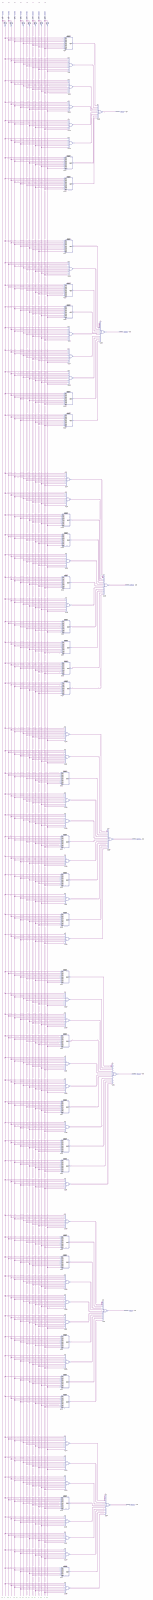
[diagram p0: schematic sheet, whole]
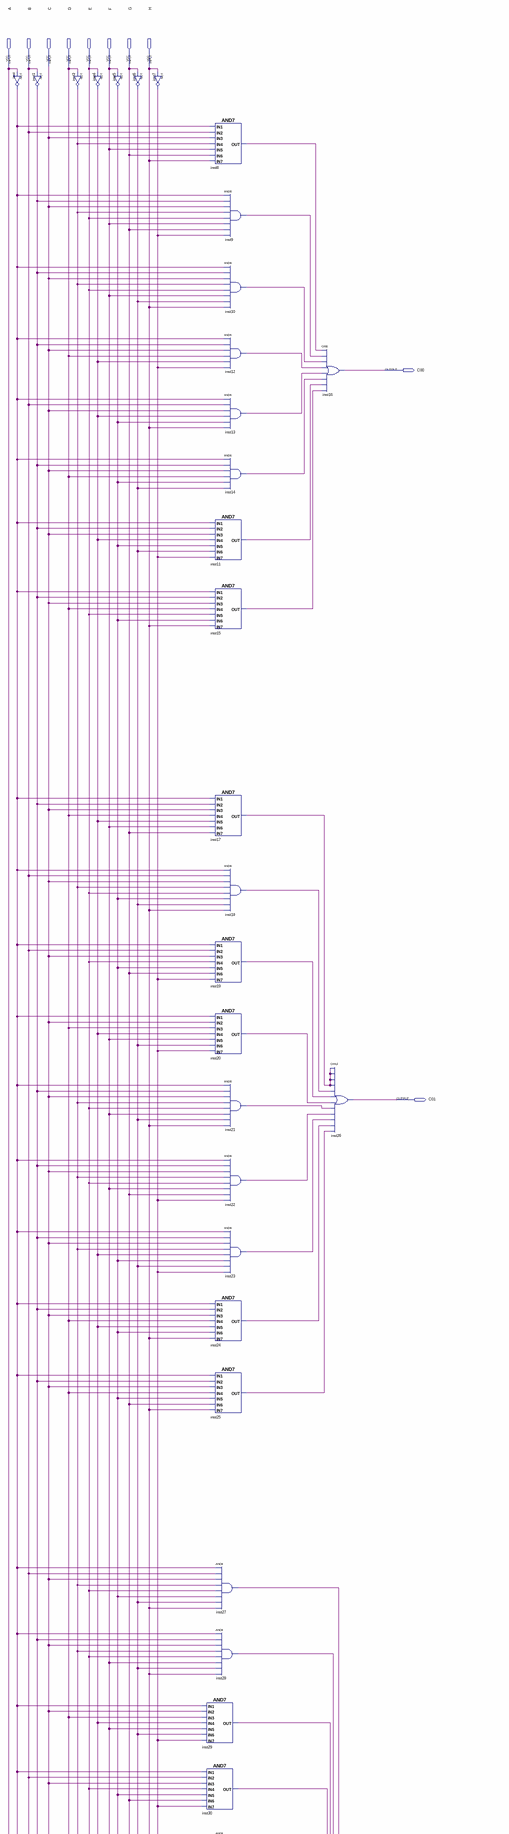
[diagram p1: schematic sheet, upper part]
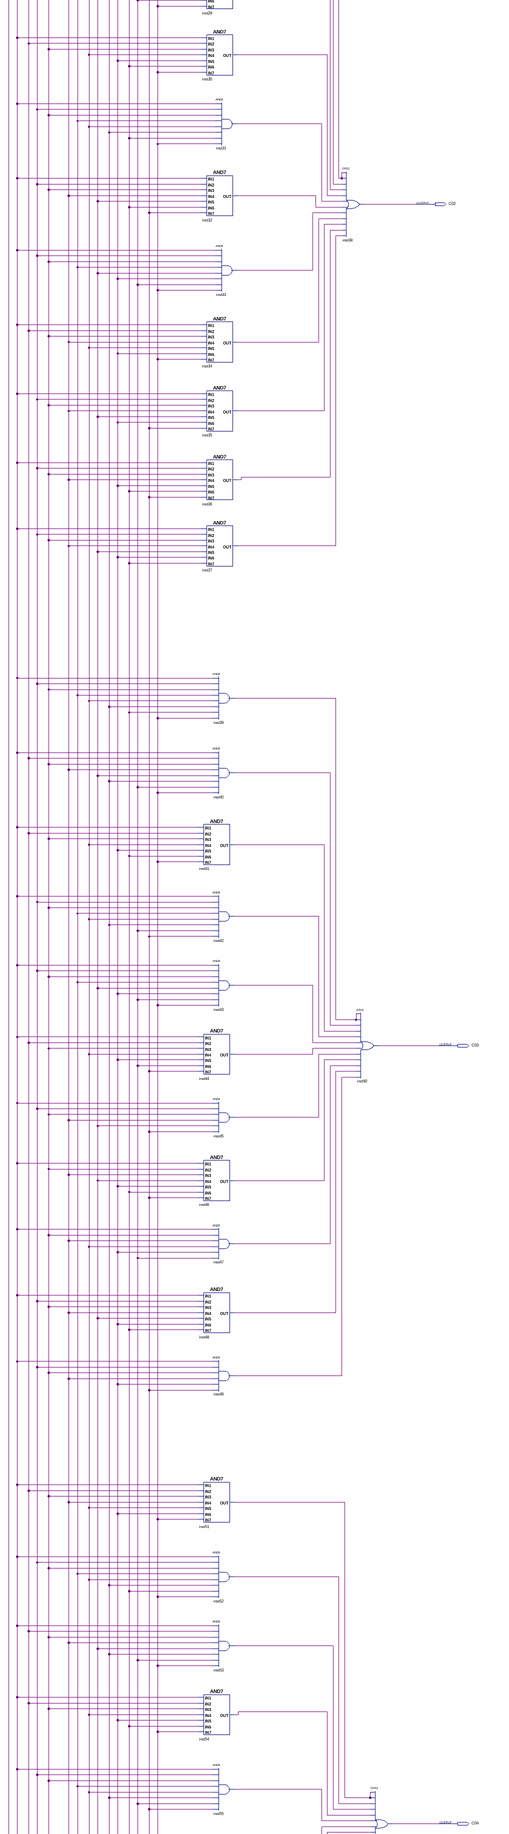
[diagram p2: schematic sheet, middle part]
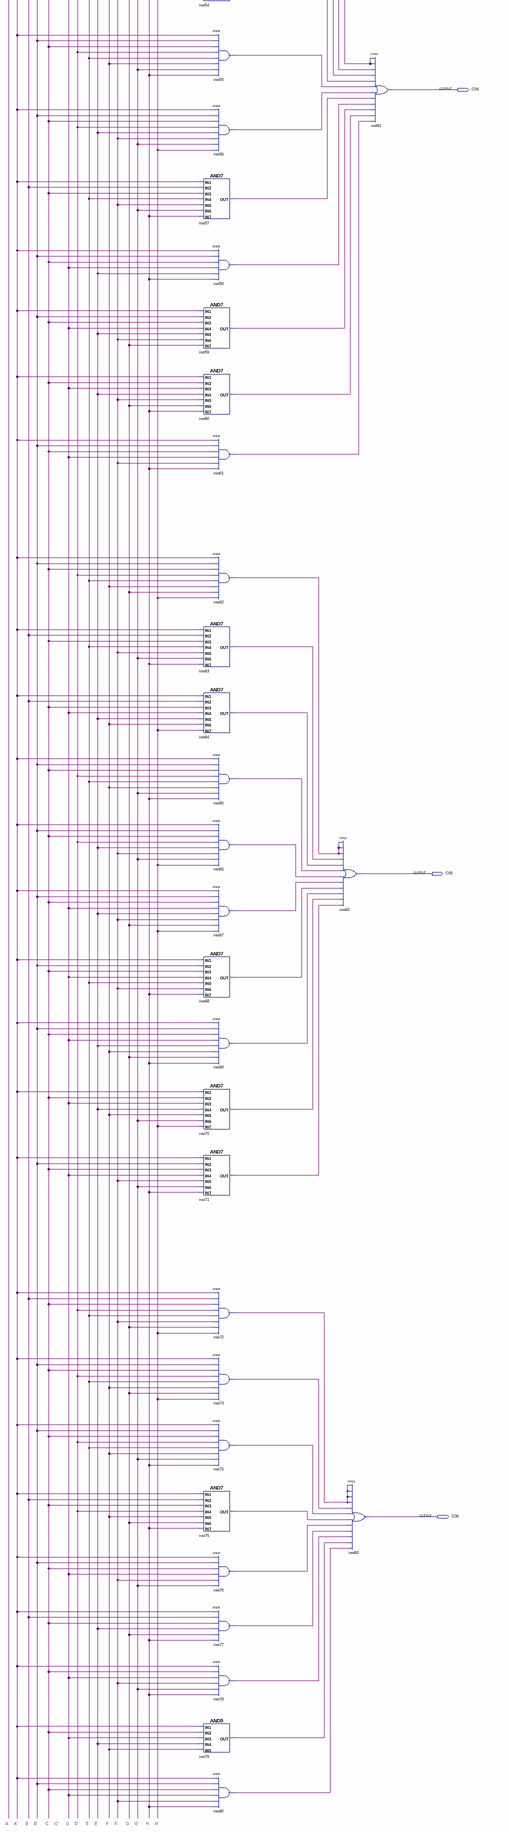
[diagram p3: schematic sheet, lower part]
// Quartus schematic matriz_coluna0.bdf as structural Verilog: 83 symbols, 15 pins
module matriz_coluna0 (
  input  A,
  input  B,
  input  C,
  input  D,
  input  E,
  input  F,
  input  G,
  input  H,
  output C00,
  output C01,
  output C02,
  output C03,
  output C04,
  output C05,
  output C06
);

  wire inst1_out, inst3_out, inst4_out, inst5_out, inst6_out, inst7_out, inst8_out, inst9_out, inst10_out,
       inst11_out, inst12_out, inst13_out, inst14_out, inst15_out, inst17_out, inst18_out, inst19_out,
       inst20_out, inst21_out, inst22_out, inst23_out, inst24_out, inst25_out, inst27_out, inst28_out,
       inst29_out, inst30_out, inst31_out, inst32_out, inst33_out, inst34_out, inst35_out, inst36_out,
       inst37_out, inst39_out, inst40_out, inst41_out, inst42_out, inst43_out, inst44_out, inst45_out,
       inst46_out, inst47_out, inst48_out, inst49_out, inst51_out, inst52_out, inst53_out, inst54_out,
       inst55_out, inst56_out, inst57_out, inst58_out, inst59_out, inst60_out, inst61_out, inst62_out,
       inst63_out, inst64_out, inst65_out, inst66_out, inst67_out, inst68_out, inst69_out, inst70_out,
       inst71_out, inst72_out, inst73_out, inst74_out, inst75_out, inst76_out, inst77_out, inst78_out,
       inst79_out, inst80_out, inst_out;

  not inst (inst_out, A);
  not inst1 (inst1_out, B);
  not inst3 (inst3_out, D);
  not inst4 (inst4_out, E);
  not inst5 (inst5_out, F);
  not inst6 (inst6_out, G);
  not inst7 (inst7_out, H);
  and inst8 (inst8_out, inst_out, B, C, inst3_out, F, G, H);
  and inst11 (inst11_out, inst_out, inst1_out, C, inst4_out, inst5_out, inst6_out, inst7_out);
  and inst15 (inst15_out, inst_out, inst1_out, C, D, E, inst5_out, H);
  and inst17 (inst17_out, inst_out, inst1_out, C, D, inst4_out, F, G);
  and inst19 (inst19_out, inst_out, B, C, E, inst5_out, G, inst7_out);
  and inst20 (inst20_out, inst_out, C, D, inst4_out, F, inst6_out, inst7_out);
  and inst24 (inst24_out, inst_out, inst1_out, C, D, inst4_out, inst5_out, H);
  and inst25 (inst25_out, inst_out, inst1_out, C, D, inst5_out, G, H);
  and inst27 (inst27_out, inst_out, B, C, inst3_out, E, inst5_out, inst6_out, H);
  and inst28 (inst28_out, inst_out, inst1_out, C, inst3_out, E, F, inst6_out, H);
  and inst29 (inst29_out, inst_out, C, D, inst4_out, F, inst6_out, inst7_out);
  and inst30 (inst30_out, inst_out, B, C, E, inst5_out, G, inst7_out);
  and inst31 (inst31_out, inst_out, inst1_out, C, inst3_out, E, F, G, inst7_out);
  and inst32 (inst32_out, inst_out, inst1_out, C, D, inst4_out, G, H);
  and inst33 (inst33_out, inst_out, inst1_out, C, inst3_out, inst4_out, inst5_out, inst6_out, inst7_out);
  and inst34 (inst34_out, inst_out, B, C, D, E, inst5_out, inst7_out);
  and inst35 (inst35_out, inst_out, inst1_out, C, D, inst4_out, inst5_out, H);
  and inst36 (inst36_out, inst_out, inst1_out, C, D, inst5_out, G, H);
  and inst37 (inst37_out, inst_out, inst1_out, C, D, inst4_out, inst5_out, G);
  and inst39 (inst39_out, inst_out, inst1_out, C, inst3_out, E, F, G, inst7_out);
  and inst40 (inst40_out, inst_out, B, C, D, inst4_out, F, inst6_out, inst7_out);
  and inst41 (inst41_out, inst_out, B, C, E, inst5_out, G, inst7_out);
  and inst42 (inst42_out, inst_out, inst1_out, C, inst3_out, E, F, inst6_out, H);
  and inst43 (inst43_out, inst_out, inst1_out, C, inst3_out, inst4_out, inst5_out, inst6_out, inst7_out);
  and inst44 (inst44_out, inst_out, B, C, E, inst5_out, inst6_out, H);
  and inst45 (inst45_out, inst_out, inst1_out, C, D, inst4_out, H);
  and inst46 (inst46_out, inst_out, C, D, inst4_out, inst5_out, G, H);
  and inst47 (inst47_out, inst_out, C, D, E, inst5_out, inst6_out);
  and inst48 (inst48_out, inst_out, inst1_out, C, D, inst4_out, inst5_out, G);
  and inst49 (inst49_out, inst_out, inst1_out, C, D, inst5_out, H);
  and inst51 (inst51_out, inst_out, B, C, D, E, inst5_out, inst7_out);
  and inst52 (inst52_out, inst_out, inst1_out, C, inst3_out, E, F, G, inst7_out);
  and inst53 (inst53_out, inst_out, B, C, D, inst4_out, F, inst6_out, inst7_out);
  and inst54 (inst54_out, inst_out, B, C, E, inst5_out, G, inst7_out);
  and inst55 (inst55_out, inst_out, inst1_out, C, inst3_out, E, F, inst6_out, H);
  and inst56 (inst56_out, inst_out, inst1_out, C, inst3_out, inst4_out, inst5_out, inst6_out, inst7_out);
  and inst57 (inst57_out, inst_out, B, C, E, inst5_out, inst6_out, H);
  and inst58 (inst58_out, inst_out, inst1_out, C, D, inst4_out, H);
  and inst59 (inst59_out, inst_out, inst1_out, C, D, inst4_out, inst5_out, G);
  and inst60 (inst60_out, inst_out, C, D, inst4_out, inst5_out, G, H);
  and inst61 (inst61_out, inst_out, inst1_out, C, D, inst5_out, H);
  and inst62 (inst62_out, inst_out, inst1_out, C, inst3_out, E, F, G, inst7_out);
  and inst63 (inst63_out, inst_out, B, C, E, inst5_out, inst6_out, H);
  and inst64 (inst64_out, inst_out, B, C, D, inst4_out, F, inst7_out);
  and inst65 (inst65_out, inst_out, inst1_out, C, inst3_out, E, F, inst6_out, H);
  and inst66 (inst66_out, inst_out, inst1_out, C, inst3_out, inst4_out, inst5_out, inst6_out, inst7_out);
  and inst67 (inst67_out, inst_out, inst1_out, C, D, inst4_out, inst5_out, G, inst7_out);
  and inst68 (inst68_out, inst_out, inst1_out, C, D, E, inst5_out, H);
  and inst69 (inst69_out, inst_out, inst1_out, C, D, inst4_out, F, G, H);
  and inst70 (inst70_out, inst_out, C, D, inst4_out, F, inst6_out, inst7_out);
  and inst71 (inst71_out, inst_out, inst1_out, C, D, inst5_out, inst6_out, H);
  and inst72 (inst72_out, inst_out, B, C, inst3_out, E, inst5_out, G, inst7_out);
  and inst73 (inst73_out, inst_out, inst1_out, C, inst3_out, E, F, G, inst7_out);
  and inst74 (inst74_out, inst_out, inst1_out, C, inst3_out, E, F, inst6_out, H);
  and inst75 (inst75_out, inst_out, B, C, inst3_out, F, G, H);
  and inst76 (inst76_out, inst_out, inst1_out, C, D, inst5_out, inst6_out);
  and inst77 (inst77_out, inst_out, B, C, inst4_out, G, H);
  and inst78 (inst78_out, inst_out, C, D, inst5_out, inst6_out, H);
  and inst79 (inst79_out, inst_out, C, D, inst4_out, F);
  and inst80 (inst80_out, inst_out, inst1_out, C, D, inst5_out, H);
  and inst9 (inst9_out, inst_out, inst1_out, C, inst3_out, E, F, G, inst7_out);
  and inst10 (inst10_out, inst_out, inst1_out, C, inst3_out, E, F, inst6_out, H);
  and inst12 (inst12_out, inst_out, inst1_out, C, D, inst4_out, inst7_out);
  and inst13 (inst13_out, inst_out, B, C, inst4_out, inst5_out, H);
  and inst14 (inst14_out, inst_out, inst1_out, C, D, inst5_out, inst6_out);
  and inst18 (inst18_out, inst_out, B, C, inst3_out, E, inst5_out, inst6_out, H);
  and inst21 (inst21_out, inst_out, inst1_out, C, inst3_out, E, F, inst6_out, H);
  and inst22 (inst22_out, inst_out, inst1_out, C, inst3_out, E, F, G, inst7_out);
  and inst23 (inst23_out, inst_out, inst1_out, C, inst3_out, inst4_out, inst5_out, inst6_out, inst7_out);
  or inst16 (C00, inst8_out, inst9_out, inst10_out, inst12_out, inst13_out, inst14_out, inst11_out, inst15_out);
  or inst26 (C01, inst17_out, inst17_out, inst17_out, inst17_out, inst18_out, inst19_out, inst20_out, inst21_out, inst22_out, inst23_out, inst24_out, inst25_out);
  or inst38 (C02, inst27_out, inst27_out, inst28_out, inst29_out, inst30_out, inst31_out, inst32_out, inst33_out, inst34_out, inst35_out, inst36_out, inst37_out);
  or inst50 (C03, inst39_out, inst39_out, inst40_out, inst41_out, inst42_out, inst43_out, inst44_out, inst45_out, inst46_out, inst47_out, inst48_out, inst49_out);
  or inst82 (C05, inst62_out, inst62_out, inst62_out, inst63_out, inst64_out, inst65_out, inst66_out, inst67_out, inst68_out, inst69_out, inst70_out, inst71_out);
  or inst83 (C06, inst72_out, inst72_out, inst72_out, inst72_out, inst73_out, inst74_out, inst75_out, inst76_out, inst77_out, inst78_out, inst79_out, inst80_out);
  or inst81 (C04, inst51_out, inst51_out, inst52_out, inst53_out, inst54_out, inst55_out, inst56_out, inst57_out, inst58_out, inst59_out, inst60_out, inst61_out);

  // Notes on the sheet:
  //   A
  //   A'
  //   B
  //   B'
  //   C
  //   C'
  //   D
  //   D'
  //   E
  //   E'
  //   F
  //   F'
  //   G
  //   G'
  //   H
  //   H'
endmodule
